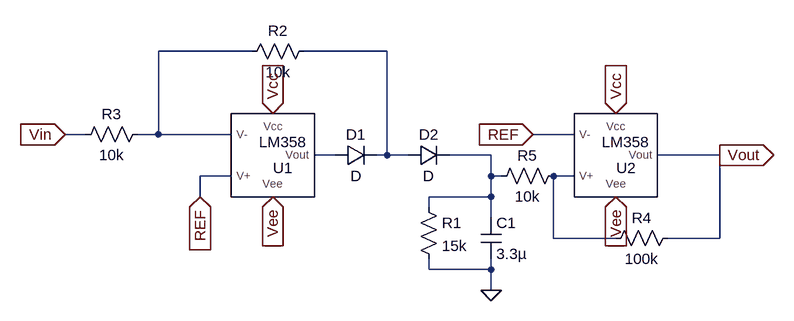
[diagram p0: schematic peak_detection.asc]
peak_detection.asc, the LTspice schematic file:
Version 4
SHEET 1 880 680
WIRE 16 16 -128 16
WIRE 224 16 96 16
WIRE -240 144 -272 144
WIRE -128 144 -128 16
WIRE -128 144 -160 144
WIRE -16 144 -128 144
WIRE 512 144 448 144
WIRE 144 176 112 176
WIRE 224 176 224 16
WIRE 224 176 208 176
WIRE 256 176 224 176
WIRE 384 176 320 176
WIRE 736 176 640 176
WIRE -16 208 -64 208
WIRE 384 208 384 176
WIRE 400 208 384 208
WIRE 512 208 480 208
WIRE -64 240 -64 208
WIRE 384 240 384 208
WIRE 384 240 288 240
WIRE 288 256 288 240
WIRE 384 272 384 240
WIRE 480 304 480 208
WIRE 576 304 480 304
WIRE 736 304 736 176
WIRE 736 304 656 304
WIRE 288 352 288 336
WIRE 384 352 384 336
WIRE 384 352 288 352
WIRE 384 384 384 352
FLAG 48 112 Vcc
IOPIN 48 112 In
FLAG 576 112 Vcc
IOPIN 576 112 In
FLAG 576 240 Vee
IOPIN 576 240 In
FLAG 48 240 Vee
IOPIN 48 240 In
FLAG -64 240 REF
IOPIN -64 240 In
FLAG 448 144 REF
IOPIN 448 144 In
FLAG -272 144 Vin
IOPIN -272 144 In
FLAG 384 384 0
FLAG 736 176 Vout
IOPIN 736 176 Out
SYMBOL LM358 64 176 R0
SYMATTR InstName U1
SYMBOL LM358 592 176 R0
SYMATTR InstName U2
SYMBOL diode 144 192 R270
WINDOW 0 32 32 VTop 2
WINDOW 3 0 32 VBottom 2
SYMATTR InstName D1
SYMBOL diode 256 192 R270
WINDOW 0 32 32 VTop 2
WINDOW 3 0 32 VBottom 2
SYMATTR InstName D2
SYMBOL res 272 240 R0
SYMATTR InstName R1
SYMATTR Value 15k
SYMBOL cap 368 272 R0
SYMATTR InstName C1
SYMATTR Value 3.3µ
SYMBOL res 112 0 R90
WINDOW 0 0 56 VBottom 2
WINDOW 3 32 56 VTop 2
SYMATTR InstName R2
SYMATTR Value 10k
SYMBOL res -144 128 R90
WINDOW 0 0 56 VBottom 2
WINDOW 3 32 56 VTop 2
SYMATTR InstName R3
SYMATTR Value 10k
SYMBOL res 672 288 R90
WINDOW 0 0 56 VBottom 2
WINDOW 3 32 56 VTop 2
SYMATTR InstName R4
SYMATTR Value 100k
SYMBOL res 496 192 R90
WINDOW 0 0 56 VBottom 2
WINDOW 3 32 56 VTop 2
SYMATTR InstName R5
SYMATTR Value 10k

The netlist it stands for:
* peak_detection.asc
XU1 N001 REF N003 Vcc Vee LM358  ; pins V- V+ Vout Vcc Vee
XU2 REF N005 Vout Vcc Vee LM358  ; pins V- V+ Vout Vcc Vee
D1 N003 N002 D
D2 N002 N004 D
R1 N004 0 15k
C1 N004 0 3.3µ
R2 N002 N001 10k
R3 N001 Vin 10k
R4 Vout N005 100k
R5 N005 N004 10k
.model D D
.lib standard.dio
.lib C:\Users\leoar\Documents\EE2\Project\Radar\SPICEMODELS\en.lm358\lm358.txt
.backanno
.end